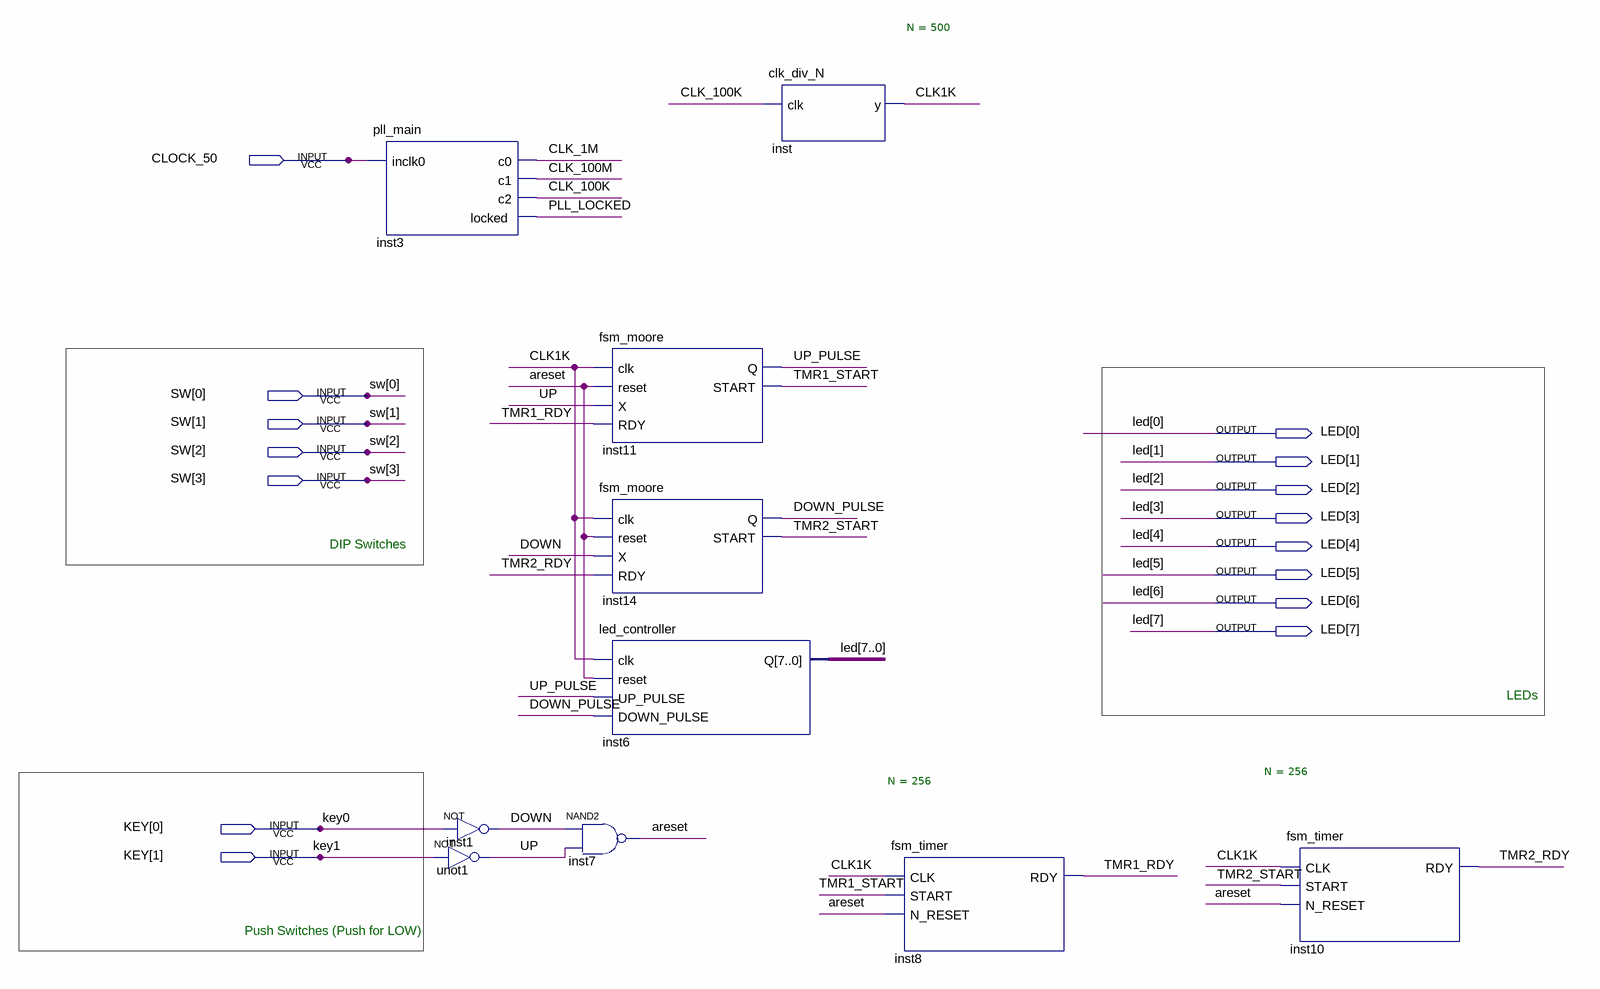
[diagram p0: schematic sheet]
// Quartus schematic TopLevelSchematic.bdf as structural Verilog: 10 symbols, 15 pins
module TopLevelSchematic (
  input  CLOCK_50,
  input  [3:0] SW,
  input  [1:0] KEY,
  output [7:0] LED
);

  wire areset, CLK1K, CLK_1M, CLK_100K, CLK_100M, DOWN, DOWN_PULSE, PLL_LOCKED, TMR1_RDY, TMR1_START,
       TMR2_RDY, TMR2_START, UP, UP_PULSE;

  pll_main inst3 (.inclk0(CLOCK_50), .c0(CLK_1M), .c1(CLK_100M), .c2(CLK_100K), .locked(PLL_LOCKED));
  not inst1 (DOWN, KEY[0]);
  not unot1 (UP, KEY[1]);
  nand inst7 (areset, DOWN, UP);
  fsm_moore inst11 (.clk(CLK1K), .reset(areset), .X(UP), .RDY(TMR1_RDY), .Q(UP_PULSE), .START(TMR1_START));
  fsm_moore inst14 (.clk(CLK1K), .reset(areset), .X(DOWN), .RDY(TMR2_RDY), .Q(DOWN_PULSE), .START(TMR2_START));
  led_controller inst6 (.clk(CLK1K), .reset(areset), .UP_PULSE(UP_PULSE), .DOWN_PULSE(DOWN_PULSE), .Q(LED));
  clk_div_N #(.N(500)) inst (.clk(CLK_100K), .y(CLK1K));
  fsm_timer #(.N(256)) inst8 (.CLK(CLK1K), .START(TMR1_START), .N_RESET(areset), .RDY(TMR1_RDY));
  fsm_timer #(.N(256)) inst10 (.CLK(CLK1K), .START(TMR2_START), .N_RESET(areset), .RDY(TMR2_RDY));

  // Notes on the sheet:
  //   DIP Switches
  //   LEDs
  //   Push Switches (Push for LOW)
endmodule
